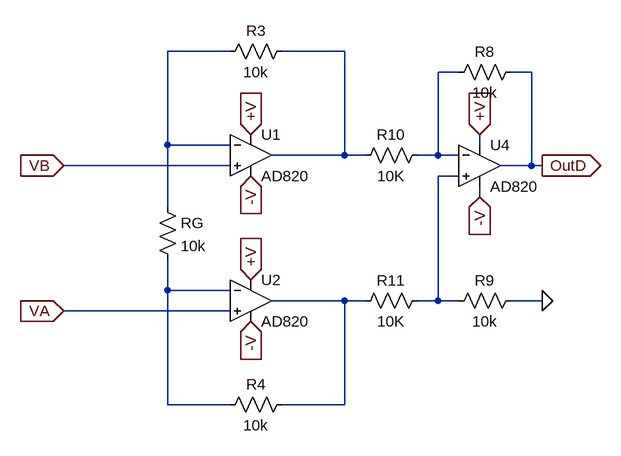
[diagram p0: schematic AI_standard_3AO_simbol.asc]
AI_standard_3AO_simbol.asc, the LTspice schematic file:
Version 4.1
SHEET 1 2004 2064
WIRE 832 48 736 48
WIRE 1008 48 912 48
WIRE 1184 80 1152 80
WIRE 1296 80 1264 80
WIRE 736 192 736 48
WIRE 832 192 736 192
WIRE 1216 192 1216 176
WIRE 1008 208 1008 48
WIRE 1008 208 896 208
WIRE 1040 208 1008 208
WIRE 1152 208 1152 80
WIRE 1152 208 1120 208
WIRE 1184 208 1152 208
WIRE 832 224 576 224
WIRE 1296 224 1296 80
WIRE 1296 224 1248 224
WIRE 1312 224 1296 224
WIRE 1184 240 1152 240
WIRE 1216 272 1216 256
WIRE 736 288 736 192
WIRE 736 416 736 368
WIRE 832 416 736 416
WIRE 1008 432 896 432
WIRE 1040 432 1008 432
WIRE 1152 432 1152 240
WIRE 1152 432 1120 432
WIRE 1184 432 1152 432
WIRE 1312 432 1264 432
WIRE 832 448 576 448
WIRE 736 592 736 416
WIRE 832 592 736 592
WIRE 1008 592 1008 432
WIRE 1008 592 912 592
FLAG 1312 432 0
FLAG 1312 224 OutD
IOPIN 1312 224 Out
FLAG 1216 176 +V
IOPIN 1216 176 In
FLAG 1216 272 -V
IOPIN 1216 272 In
FLAG 864 176 +V
IOPIN 864 176 In
FLAG 864 400 +V
IOPIN 864 400 In
FLAG 864 240 -V
IOPIN 864 240 In
FLAG 864 464 -V
IOPIN 864 464 In
FLAG 576 224 VB
IOPIN 576 224 In
FLAG 576 448 VA
IOPIN 576 448 In
SYMBOL res 1280 64 R90
WINDOW 0 0 56 VBottom 2
WINDOW 3 32 56 VTop 2
SYMATTR InstName R8
SYMATTR Value 10k
SYMATTR SpiceLine tol=1 pwr=0.1
SYMBOL res 1280 416 R90
WINDOW 0 0 56 VBottom 2
WINDOW 3 32 56 VTop 2
SYMATTR InstName R9
SYMATTR Value 10k
SYMATTR SpiceLine tol=1 pwr=0.1
SYMBOL res 1136 192 R90
WINDOW 0 0 56 VBottom 2
WINDOW 3 32 56 VTop 2
SYMATTR InstName R10
SYMATTR Value 10K
SYMATTR SpiceLine tol=1 pwr=0.1
SYMBOL res 1136 416 R90
WINDOW 0 0 56 VBottom 2
WINDOW 3 32 56 VTop 2
SYMATTR InstName R11
SYMATTR Value 10K
SYMATTR SpiceLine tol=1 pwr=0.1
SYMBOL res 720 272 R0
SYMATTR InstName RG
SYMATTR Value 10k
SYMATTR SpiceLine tol=1 pwr=0.1
SYMBOL res 928 32 R90
WINDOW 0 0 56 VBottom 2
WINDOW 3 32 56 VTop 2
SYMATTR InstName R3
SYMATTR Value 10k
SYMATTR SpiceLine tol=1 pwr=0.1
SYMBOL res 928 576 R90
WINDOW 0 0 56 VBottom 2
WINDOW 3 32 56 VTop 2
SYMATTR InstName R4
SYMATTR Value 10k
SYMATTR SpiceLine tol=1 pwr=0.1
SYMBOL OpAmps\\AD820 1216 160 R0
SYMATTR InstName U4
SYMBOL OpAmps\\AD820 864 144 R0
SYMATTR InstName U1
SYMBOL OpAmps\\AD820 864 368 R0
SYMATTR InstName U2

The netlist it stands for:
* AI_standard_3AO_simbol.asc
R8 OutD N003 10k tol=1 pwr=0.1
R9 0 N004 10k tol=1 pwr=0.1
R10 N003 N002 10K tol=1 pwr=0.1
R11 N004 N006 10K tol=1 pwr=0.1
RG N001 N005 10k tol=1 pwr=0.1
R3 N002 N001 10k tol=1 pwr=0.1
R4 N006 N005 10k tol=1 pwr=0.1
X§U4 N004 N003 +V -V OutD AD820  ; pins In+ In- V+ V- OUT
X§U1 VB N001 +V -V N002 AD820  ; pins In+ In- V+ V- OUT
X§U2 VA N005 +V -V N006 AD820  ; pins In+ In- V+ V- OUT
.backanno
.end